# Altium schematic sheet Top_Sheet.SchDoc
size 420 x 297 mm; SheetNumber: 1; SheetTotal: 3
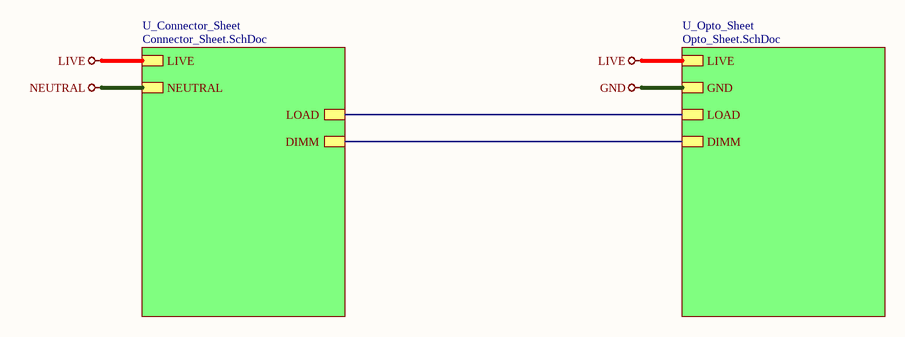
[diagram p0: Top_Sheet.SchDoc]

## Sub-sheets
U_Connector_Sheet = Connector_Sheet.SchDoc: NEUTRAL, LIVE, LOAD, DIMM
U_Opto_Sheet = Opto_Sheet.SchDoc: LIVE, GND, DIMM, LOAD

## Nets
GND: sheet U_Opto_Sheet/GND
LIVE: sheet U_Connector_Sheet/LIVE, sheet U_Opto_Sheet/LIVE
NEUTRAL: sheet U_Connector_Sheet/NEUTRAL
(unnamed): sheet U_Connector_Sheet/LOAD, sheet U_Opto_Sheet/LOAD
(unnamed): sheet U_Connector_Sheet/DIMM, sheet U_Opto_Sheet/DIMM

## Notes on the sheet
- File:
- Title:
- Date:
- Page
- Num:
- Total:
- Drawn By: Huzaifa Ali